# Altium schematic sheet driver.SchDoc: MJVESC MINI - Driver
size A3; Author: Dongil Choi; Organization: DRC LAB, Myongji University; Address1: Engineering Building 1, #214; Address2: 116 Myongji-ro, Cheoin-Gu; Address3: Yongin-si, Gyeonggi-Do; Address4: South Korea, 17058; DocumentNumber: 2; Revision: 0.3A; SheetNumber: 2; SheetTotal: 3
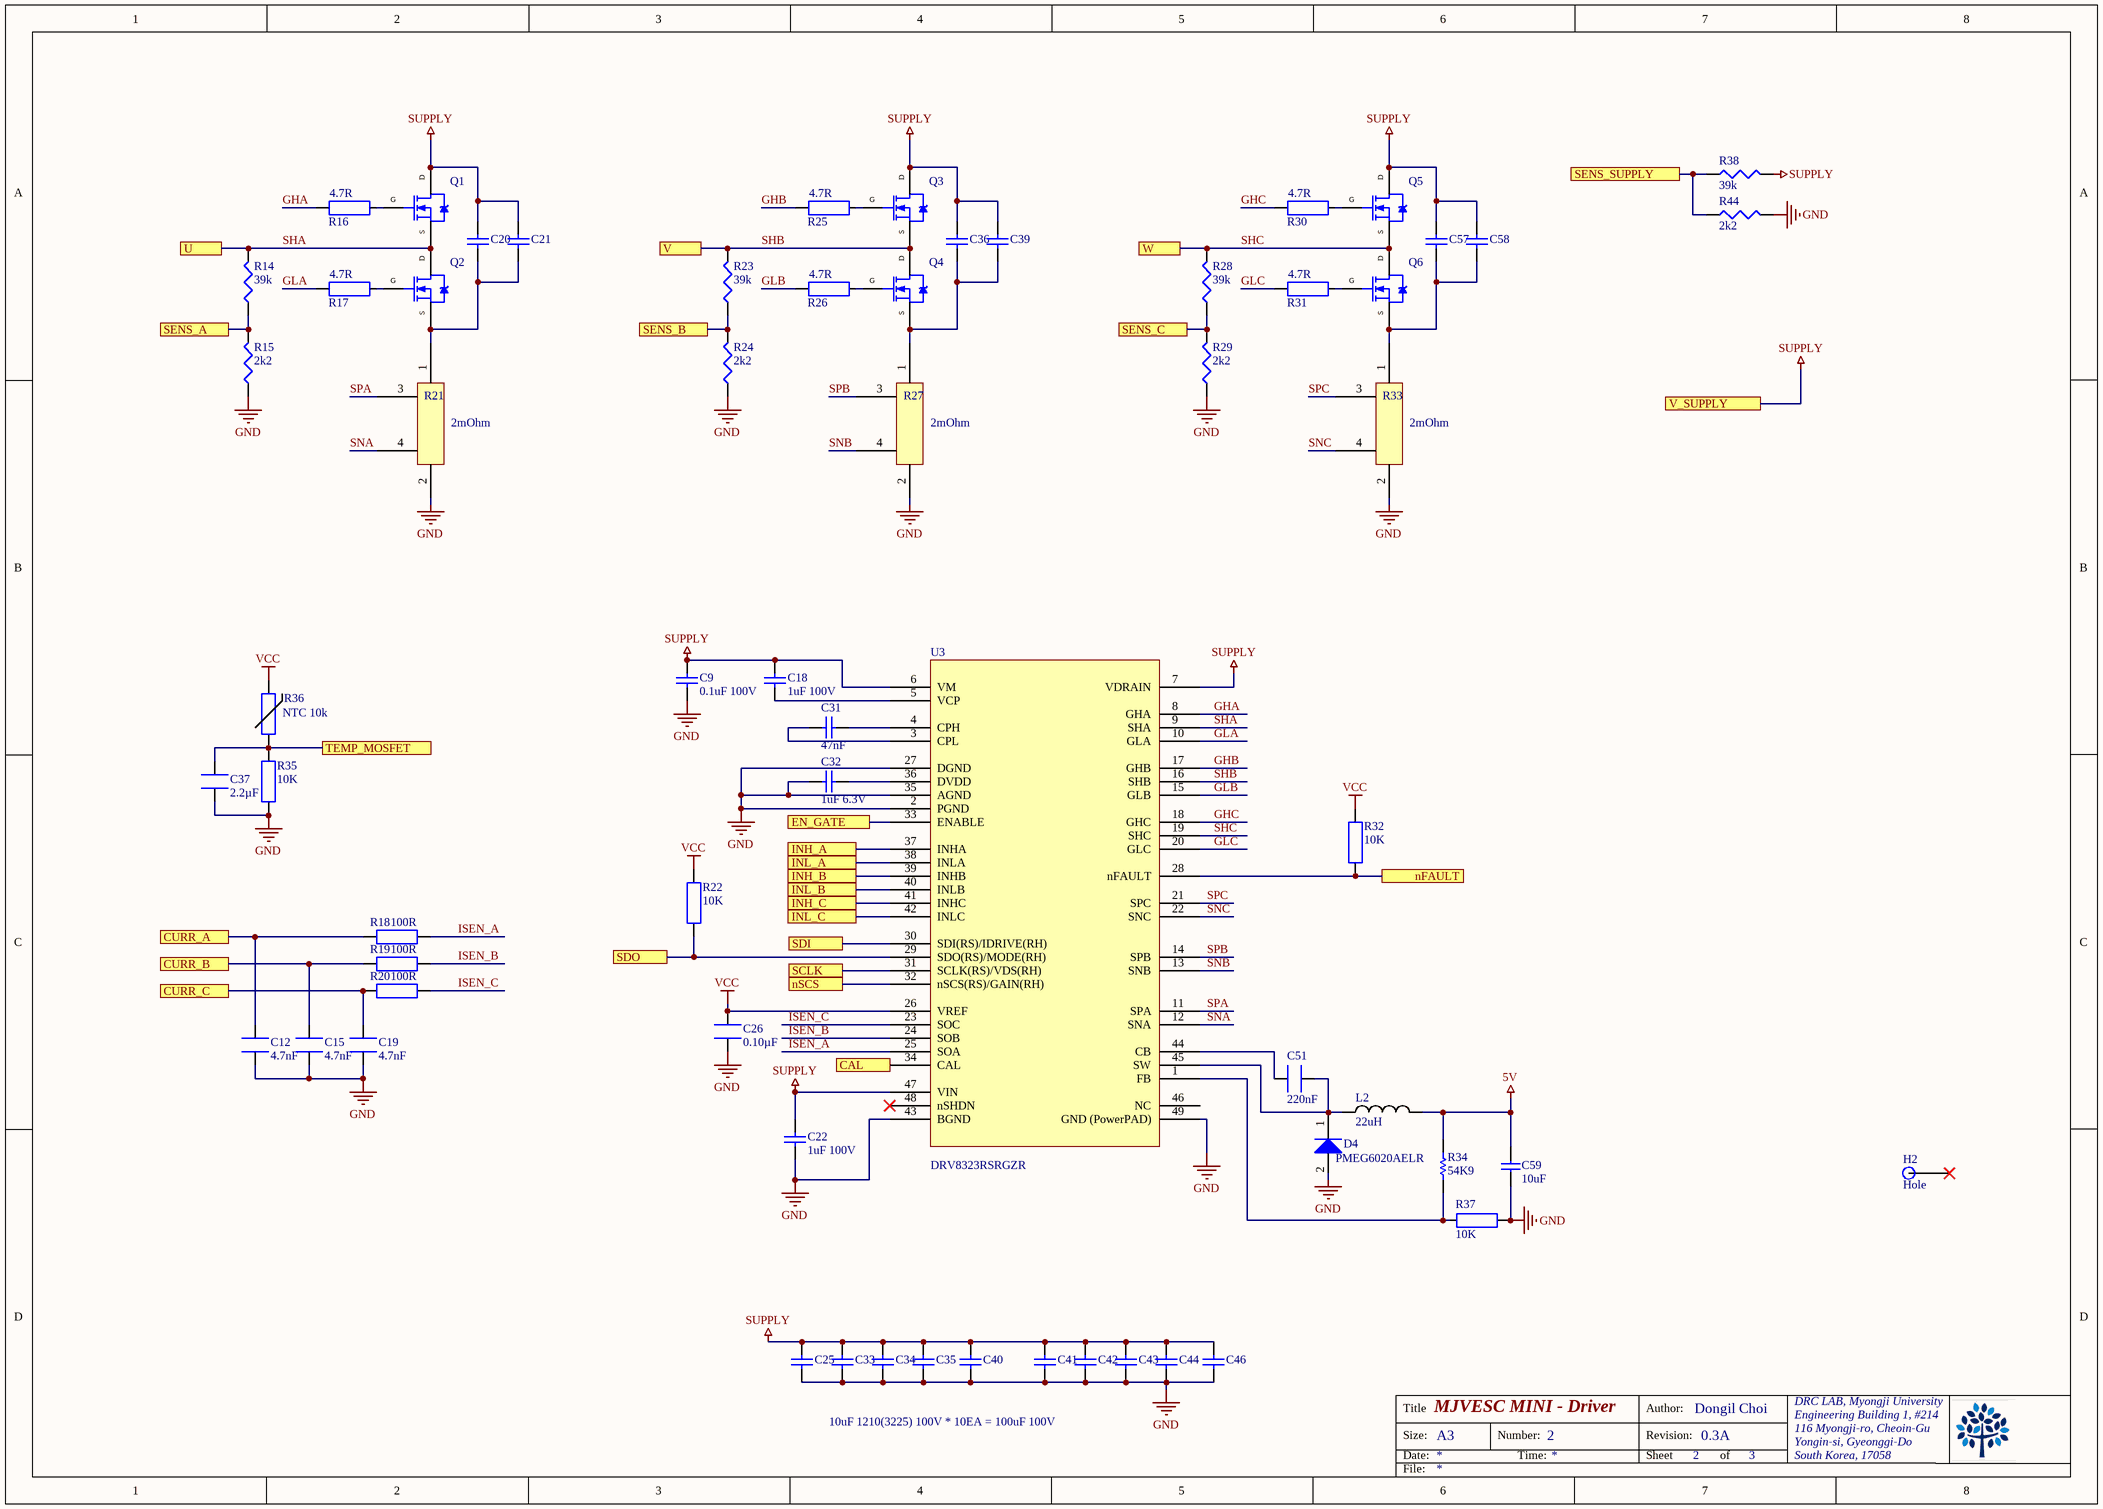
[diagram p0: driver.SchDoc]

## Parts
C9  0.1uF 100V  [CAP 0603/1608]
C12  4.7nF  [CAP 0603/1608]
C15  4.7nF  [CAP 0603/1608]
C18  1uF 100V  [C0805]
C19  4.7nF  [CAP 0603/1608]
C20  CAP 10uF 100V 1210(3225)  [CAPC1210(3225)280_N]  (value not drawn)
C21  CAP 10uF 100V 1210(3225)  [CAPC1210(3225)280_N]  (value not drawn)
C22  1uF 100V  [C0805]
C25  CAP 10uF 100V 1210(3225)  [CAPC1210(3225)280_N]  (value not drawn)
C26  0.10µF  [CAP 0603/1608]
C31  47nF  [CAPC0603(1608)100_L]
C32  1uF 6.3V  [CAPC0603(1608)100_N]
C33  CAP 10uF 100V 1210(3225)  [CAPC1210(3225)280_N]  (value not drawn)
C34  CAP 10uF 100V 1210(3225)  [CAPC1210(3225)280_N]  (value not drawn)
C35  CAP 10uF 100V 1210(3225)  [CAPC1210(3225)280_N]  (value not drawn)
C36  CAP 10uF 100V 1210(3225)  [CAPC1210(3225)280_N]  (value not drawn)
C37  2.2µF  [CAP 0603/1608]
C39  CAP 10uF 100V 1210(3225)  [CAPC1210(3225)280_N]  (value not drawn)
C40  CAP 10uF 100V 1210(3225)  [CAPC1210(3225)280_N]  (value not drawn)
C41  CAP 10uF 100V 1210(3225)  [CAPC1210(3225)280_N]  (value not drawn)
C42  CAP 10uF 100V 1210(3225)  [CAPC1210(3225)280_N]  (value not drawn)
C43  CAP 10uF 100V 1210(3225)  [CAPC1210(3225)280_N]  (value not drawn)
C44  CAP 10uF 100V 1210(3225)  [CAPC1210(3225)280_N]  (value not drawn)
C46  CAP 10uF 100V 1210(3225)  [CAPC1210(3225)280_N]  (value not drawn)
C51  220nF  [CAP 0603/1608]
C57  CAP 10uF 100V 1210(3225)  [CAPC1210(3225)280_N]  (value not drawn)
C58  CAP 10uF 100V 1210(3225)  [CAPC1210(3225)280_N]  (value not drawn)
C59  10uF  [CAPC1206(3216)190_M]
D4  PMEG6020AELR  [SOD123W]
H2  Hole  [M2-HOLE]
L2  22uH  [74438335220]
Q1  NTMFS5C604NLT1G  [DFN500X600X110-5N]  (value not drawn)
Q2  NTMFS5C604NLT1G  [DFN500X600X110-5N]  (value not drawn)
Q3  NTMFS5C604NLT1G  [DFN500X600X110-5N]  (value not drawn)
Q4  NTMFS5C604NLT1G  [DFN500X600X110-5N]  (value not drawn)
Q5  NTMFS5C604NLT1G  [DFN500X600X110-5N]  (value not drawn)
Q6  NTMFS5C604NLT1G  [DFN500X600X110-5N]  (value not drawn)
R14  39k  [RES 0603/1608]
R15  2k2  [RES 0603/1608]
R16  4.7R  [RES 0603/1608]
R17  4.7R  [RES 0603/1608]
R18  100R  [RES 0603/1608]
R19  100R  [RES 0603/1608]
R20  100R  [RES 0603/1608]
R21  2mOhm  [CSS2H-2512K-2L00F]
R22  10K  [RES 0603/1608]
R23  39k  [RES 0603/1608]
R24  2k2  [RES 0603/1608]
R25  4.7R  [RES 0603/1608]
R26  4.7R  [RES 0603/1608]
R27  2mOhm  [CSS2H-2512K-2L00F]
R28  39k  [RES 0603/1608]
R29  2k2  [RES 0603/1608]
R30  4.7R  [RES 0603/1608]
R31  4.7R  [RES 0603/1608]
R32  10K  [RES 0603/1608]
R33  2mOhm  [CSS2H-2512K-2L00F]
R34  54K9  [RESC0603(1608)_M]
R35  10K  [RES 0603/1608]
R36  NTC 10k  [RES 0402/1005]
R37  10K  [RES 0603/1608]
R38  39k  [RES 0603/1608]
R44  2k2  [RES 0603/1608]
U3  DRV8323RSRGZR  [VQFN-48_N]

## Ports
CAL, CURR_A, CURR_B, CURR_C, EN_GATE, INH_A, INH_B, INH_C, INL_A, INL_B, INL_C, nFAULT, nSCS, SCLK, SDI, SDO, SENS_A, SENS_B, SENS_C, SENS_SUPPLY, TEMP_MOSFET, U, V, V_SUPPLY, W

## Nets
5V: C59.2 L2.2 R34.2
GND: C9.1 C12.2 C15.2 C19.2 C22.1 C25.2 C26.2 C32.1 C33.2 C34.2 C35.2 C37.1 C40.2 C41.2 C42.2 C43.2 C44.2 C46.2 C59.1 D4.2(A) R15.1 R21.2 R24.1 R27.2 R29.1 R33.2 R35.2 R37.2 R44.2 U3.2(PGND) U3.27(DGND) U3.35(AGND) U3.43(BGND) U3.49(GND_(PowerPAD))
SUPPLY: C9.2 C18.2 C20.1 C21.1 C22.2 C25.1 C33.1 C34.1 C35.1 C36.1 C39.1 C40.1 C41.1 C42.1 C43.1 C44.1 C46.1 C57.1 C58.1 Q1.5_6(D) Q1.5_6_1(D) Q1.5_6_2(D) Q1.5_6_3(D) Q1.5_6_4(D) Q3.5_6(D) Q3.5_6_1(D) Q3.5_6_2(D) Q3.5_6_3(D) Q3.5_6_4(D) Q5.5_6(D) Q5.5_6_1(D) Q5.5_6_2(D) Q5.5_6_3(D) Q5.5_6_4(D) R38.2 U3.6(VM) U3.7(VDRAIN) U3.47(VIN) ; port V_SUPPLY
VCC: C26.1 R22.1 R32.1 R36.2 U3.26(VREF)
CAL: U3.34(CAL) ; port CAL
CURR_A: C12.1 R18.2 ; port CURR_A
CURR_B: C15.1 R19.2 ; port CURR_B
CURR_C: C19.1 R20.2 ; port CURR_C
EN_GATE: U3.33(ENABLE) ; port EN_GATE
GHA: R16.1 U3.8(GHA)
GHB: R25.1 U3.17(GHB)
GHC: R30.1 U3.18(GHC)
GLA: R17.1 U3.10(GLA)
GLB: R26.1 U3.15(GLB)
GLC: R31.1 U3.20(GLC)
INH_A: U3.37(INHA) ; port INH_A
INH_B: U3.39(INHB) ; port INH_B
INH_C: U3.41(INHC) ; port INH_C
INL_A: U3.38(INLA) ; port INL_A
INL_B: U3.40(INLB) ; port INL_B
INL_C: U3.42(INLC) ; port INL_C
ISEN_A: R18.1 U3.25(SOA)
ISEN_B: R19.1 U3.24(SOB)
ISEN_C: R20.1 U3.23(SOC)
nFAULT: R32.2 U3.28(nFAULT) ; port nFAULT
nSCS: U3.32(nSCS(RS)/GAIN(RH)) ; port nSCS
SCLK: U3.31(SCLK(RS)/VDS(RH)) ; port SCLK
SDI: U3.30(SDI(RS)/IDRIVE(RH)) ; port SDI
SDO: R22.2 U3.29(SDO(RS)/MODE(RH)) ; port SDO
SENS_A: R14.1 R15.2 ; port SENS_A
SENS_B: R23.1 R24.2 ; port SENS_B
SENS_C: R28.1 R29.2 ; port SENS_C
SENS_SUPPLY: R38.1 R44.1 ; port SENS_SUPPLY
SHA: Q1.1(S) Q1.2(S) Q1.3(S) Q2.5_6(D) Q2.5_6_1(D) Q2.5_6_2(D) Q2.5_6_3(D) Q2.5_6_4(D) R14.2 U3.9(SHA) ; port U
SHB: Q3.1(S) Q3.2(S) Q3.3(S) Q4.5_6(D) Q4.5_6_1(D) Q4.5_6_2(D) Q4.5_6_3(D) Q4.5_6_4(D) R23.2 U3.16(SHB) ; port V
SHC: Q5.1(S) Q5.2(S) Q5.3(S) Q6.5_6(D) Q6.5_6_1(D) Q6.5_6_2(D) Q6.5_6_3(D) Q6.5_6_4(D) R28.2 U3.19(SHC) ; port W
SNA: R21.4 U3.12(SNA)
SNB: R27.4 U3.13(SNB)
SNC: R33.4 U3.22(SNC)
SPA: R21.3 U3.11(SPA)
SPB: R27.3 U3.14(SPB)
SPC: R33.3 U3.21(SPC)
TEMP_MOSFET: C37.2 R35.1 R36.1 ; port TEMP_MOSFET
NetC18_1: C18.1 U3.5(VCP)
NetC20_2: C20.2 C21.2 Q2.1(S) Q2.2(S) Q2.3(S) R21.1
NetC31_1: C31.1 U3.3(CPL)
NetC31_2: C31.2 U3.4(CPH)
NetC32_2: C32.2 U3.36(DVDD)
NetC36_2: C36.2 C39.2 Q4.1(S) Q4.2(S) Q4.3(S) R27.1
NetC51_1: C51.1 D4.1(K) L2.1 U3.45(SW)
NetC51_2: C51.2 U3.44(CB)
NetC57_2: C57.2 C58.2 Q6.1(S) Q6.2(S) Q6.3(S) R33.1
NetQ1_4: Q1.4(G) R16.2
NetQ2_4: Q2.4(G) R17.2
NetQ3_4: Q3.4(G) R25.2
NetQ4_4: Q4.4(G) R26.2
NetQ5_4: Q5.4(G) R30.2
NetQ6_4: Q6.4(G) R31.2
NetR34_1: R34.1 R37.1 U3.1(FB)

Not connected (* = marked no-connect by the designer): H2 0*; U3 46(NC) 48(nSHDN)*

## Notes on the sheet
- 10uF 1210(3225) 100V * 10EA = 100uF 100V
- Title
- Size:
- Date:
- A3
- Number:
- Time:
- Revision:
- Sheet
- Author:
- of
- File:

## Library data of the parts
C9 = CAP: Multilayer Ceramic Capacitors MLCC - SMD/SMT 0603 0.1uF 100volts X7R 10%; Manufacturer: Murata; PartNumber: GCJ188R72A104KA01D
C12 C15 C19 = GRM1885C1H222JA01D: CAP CER 4.7nF 50V NP0 0603; PartNumber: GRM1887U1H472JA01D
C18 = CAP: Multilayer Ceramic Capacitors MLCC - SMD/SMT 1.0UF 100V 10% 0805; Manufacturer: Murata; PartNumber: GRM21BC72A105KE01L
C20 C21 C25 C33-C36 C39-C44 C46 C57 C58 = CMP-1038-02106-1: 100Vdc 10uF 10% 1210/2502; PartNumber: GRM32EC72A106KE05L; Case-EIA: 1210; Case-Metric: 3225; Tolerance: Â±20%; Technology: SMT; Value: 10uF; Max Thickness: 2.8 mm; Rated Voltage: 100 V
C22 = CAP: Multilayer Ceramic Capacitors MLCC - SMD/SMT 1.0UF 100V 10% 0805; Manufacturer: Murata; Part Number: GRM21BC72A105KE01L
C26 = GRM188R71E104KA01D: CAP CER 0.1UF 25V X7R 0603; Manufacturer: Murata Electronics North America; Tolerance: ±10%; Supplier 1: Digi-Key; Supplier Part Number 1: 490-1524-1-ND; Manufacturer Part Number: GRM188R71E104KA01D; RoHS: RoHS Compliant; Category: Capacitors; Stock 1: 1667481; Pricing 1: 1=0.1, 10=0.019, 50=0.0104, 100=0.0088, 250=0.0072, 500=0.00616, 1000=0.0048 (USD); Packaging: Cut Tape (CT); Capacitance: 0.10µF; Voltage - Rated: 25V; Temperature Coefficient: X7R; Mounting Type: Surface Mount, MLCC; Operating Temperature: -55°C ~ 125°C; Applications: General Purpose; Ratings: -; Package / Case: 0603 (1608 Metric); Size / Dimension: 0.063" L x 0.031" W (1.60mm x 0.80mm); Height - Seated (Max): -; Thickness (Max): 0.035" (0.90mm); Lead Spacing: -; Features: -; Lead Style: -; ComponentLink1URL: http://www.murata.com/~/media/webrenewal/support/library/catalog/products/capacitor/mlcc/c02e.pdf; ComponentLink1Description: http://www.murata.com/~/media/webrenewal/support/library/catalog/products/capacitor/mlcc/c02e.pdf; PartNumber: GRM188R71E104KA01D
C31 = CMP-1035-02502-1: CAP 47nF 16V ±5% 0603 (1608 Metric) Thickness 1mm SMD; PartNumber: CC0603KRX7R7BB473; Tolerance: Â±10%; Case-Metric: 1608; Case-EIA: 0603; Value: 47nF; Technology: SMT; Rated Voltage: 16 V; Max Thickness: 1 mm
C32 = CMP-1035-02730-1: CAP 1uF 6.3V ±10% 0603 (1608 Metric) Thickness 1mm SMD; PartNumber: CC0603KRX7R5BB105; Case-EIA: 0603; Case-Metric: 1608; Tolerance: Â±10%; Rated Voltage: 6.3 V; Max Thickness: 1 mm; Technology: SMT; Value: 1uF
C37 = GRM188R61C225KE15D: CAP CER 2.2UF 16V X5R 0603; Manufacturer: Murata Electronics North America; Tolerance: ±10%; Supplier 1: Digi-Key; Supplier Part Number 1: 490-3296-1-ND; Manufacturer Part Number: GRM188R61C225KE15D; RoHS: RoHS Compliant; Category: Capacitors; Stock 1: 1255740; Pricing 1: 1=0.12, 10=0.08, 50=0.046, 100=0.038, 250=0.032, 500=0.0268, 1000=0.022 (USD); Packaging: Cut Tape (CT); Capacitance: 2.2µF; Voltage - Rated: 16V; Temperature Coefficient: X5R; Mounting Type: Surface Mount, MLCC; Operating Temperature: -55°C ~ 85°C; Applications: General Purpose; Ratings: -; Package / Case: 0603 (1608 Metric); Size / Dimension: 0.063" L x 0.031" W (1.60mm x 0.80mm); Height - Seated (Max): -; Thickness (Max): 0.035" (0.90mm); Lead Spacing: -; Features: -; Lead Style: -; ComponentLink1URL: http://www.murata.com/~/media/webrenewal/support/library/catalog/products/capacitor/mlcc/c02e.pdf; ComponentLink1Description: http://www.murata.com/~/media/webrenewal/support/library/catalog/products/capacitor/mlcc/c02e.pdf; PartNumber: GRM188R61C225KE15D
C51 = GRM188R71E104KA01D: CAP CER 220nF 50V X7R 0603; PartNumber: GRM188R71H224KAC4J
C59 = CGA5L1X8L1C106K160AC: Multilayer Ceramic Capacitors MLCC - SMD/SMT 16V 10uF 10% 1.60mm X8L AEC-Q200; PartNumber: CGA5L1X8L1C106K160AC
D4 = PMEG6020AELR: 60 V, 2 A low leakage current Schottky barrier rectifier; PartNumber: PMEG6020AELR
H2 = Hole: M2, M2.5, M3 Hole
L2 = 74438335220: Fixed Inductors WE-MAPI SMD 3015 22uH 0.60A 1040mOhm; PartNumber: 74438335220
Q1-Q6 = NTMFS5C604NLT1G: Power MOSFET / 60 V, 1.2 m, 287 A, Single N−Channel; Manufacturer: International Rectifier; Power Dissipation @ TC: 25C (W)=380; VGs Max(V): 16; ID @ TC: 100C (A)=210; Tj Max: 175; Packing: Tube; Circuit: Discrete; RDS(on) Max 4.5V (mOhms): 2.2; Rth(JC) (C/W): 0.40; RDS(on) Max 10V (mOhms): 1.9; Qg Typ (nC): 110.0; Qgd Typ (nC): 53.0; ComponentLink1URL: http://www.irf.com/; ComponentLink1Description: Manufacturer URL; ComponentLink3Description: Package Specification; ComponentLink2Description: Datasheet; Mounting Technology: Surface Mount; PackageReference: D2PAK-7; DatasheetVersion: Oct-10; PackageDescription: 7-Pin Long Leads Package Outline, Body 10.16 x 9.015 mm, Pitch 1.27 mm; ComponentLink3URL: http://ec.irf.com/v6/en/US/adirect/ir?cmd=catSearchFrame&domSendTo=byID&domProductQueryName=IRLS3036-7PPbF; ComponentLink2URL: http://www.irf.com/product-info/datasheets/data/irls3036-7ppbf.pdf; PartNumber: NTMFS5C604NLT1G
R14 R23 R28 R38 = Res3: RES SMD 39K OHM 1% 1/10W 0603; PartNumber: RC0603FR-0739KL; Published: 8-Jun-2000; LatestRevisionDate: 29-May-2009; LatestRevisionNote: IPC-7351 Footprint Added.; PackageReference: J1-0603; Publisher: Altium Limited; PackageDescription: Chip Resistor; Value: 39k
R15 R24 R29 R44 = Res3: RES SMD 2.2K OHM 1% 1/10W 0603; PartNumber: RC0603FR-072K2L; Published: 8-Jun-2000; LatestRevisionDate: 29-May-2009; LatestRevisionNote: IPC-7351 Footprint Added.; PackageReference: J1-0603; Publisher: Altium Limited; PackageDescription: Chip Resistor; Value: 2k2
R16 R17 R25 R26 R30 R31 = RC0603FR-072RL: 4.7R 0.1W 1% 0603 (1608 Metric)  SMD; PartNumber: RC0603FR-074R7L
R18-R20 = RC0603FR-07120RL: RES SMD 100R OHM 1% 1/10W 0603; PartNumber: RC0603JR-07100RL
R21 R27 R33 = CSS2H-2512K-2L00F: Current Sense Resistors - SMD 2mOhms 5W 1% AEC-Q200; PartNumber: CSS2H-2512K-2L00F
R22 R32 R35 R37 = RC0603FR-0710KL: RES SMD 10K OHM 1% 1/10W 0603; Manufacturer: Yageo; Power (Watts): 0.1W, 1/10W; Temperature Coefficient: ±100ppm/°C; Supplier 1: Digi-Key; Supplier Part Number 1: 311-10.0KHRCT-ND; Manufacturer Part Number: RC0603FR-0710KL; RoHS: RoHS Compliant; Category: Resistors; Stock 1: 13504930; Pricing 1: 1=0.1, 10=0.014, 25=0.01, 100=0.0057, 250=0.00436, 500=0.00348, 1000=0.00257, 2500=0.00223 (USD); Packaging: Cut Tape (CT); Resistance (Ohms): 10k; Tolerance: ±1%; Composition: Thick Film; Features: Moisture Resistant; Operating Temperature: -55°C ~ 155°C; Package / Case: 0603 (1608 Metric); Supplier Device Package: 0603; Size / Dimension: 0.063" L x 0.031" W (1.60mm x 0.80mm); Height: 0.022" (0.55mm); Number of Terminations: 2; ComponentLink1URL: http://www.yageo.com/documents/recent/PYu-RC_Group_51_RoHS_L_04.pdf; ComponentLink1Description: http://www.yageo.com/documents/recent/PYu-RC_Group_51_RoHS_L_04.pdf; PartNumber: RC0603FR-0710KL
R34 = CMP-1012-00707-1: 54K9 0.1W 1% 0603 (1608 Metric)  SMD; PartNumber: RC0603FR-0754K9L; Case-EIA: 0603; Case-Metric: 1608; Value: 54900.00 Ohm; Technology: SMT; Tolerance: 1 %; Power: 0.1 W
R36 = NCP15XH103F03RC: THERMISTOR 10K OHM NTC 0402 SMD; PartNumber: NCP15XH103F03RC
U3 = DRV8323RSRGZR: Gate Drivers 60V Three-Phase Smart Gate Driver With Buck Regulator and Three Current Shunt Amplifiers 48-VQFN -40 to 125; PartNumber: DRV8323RSRGZR